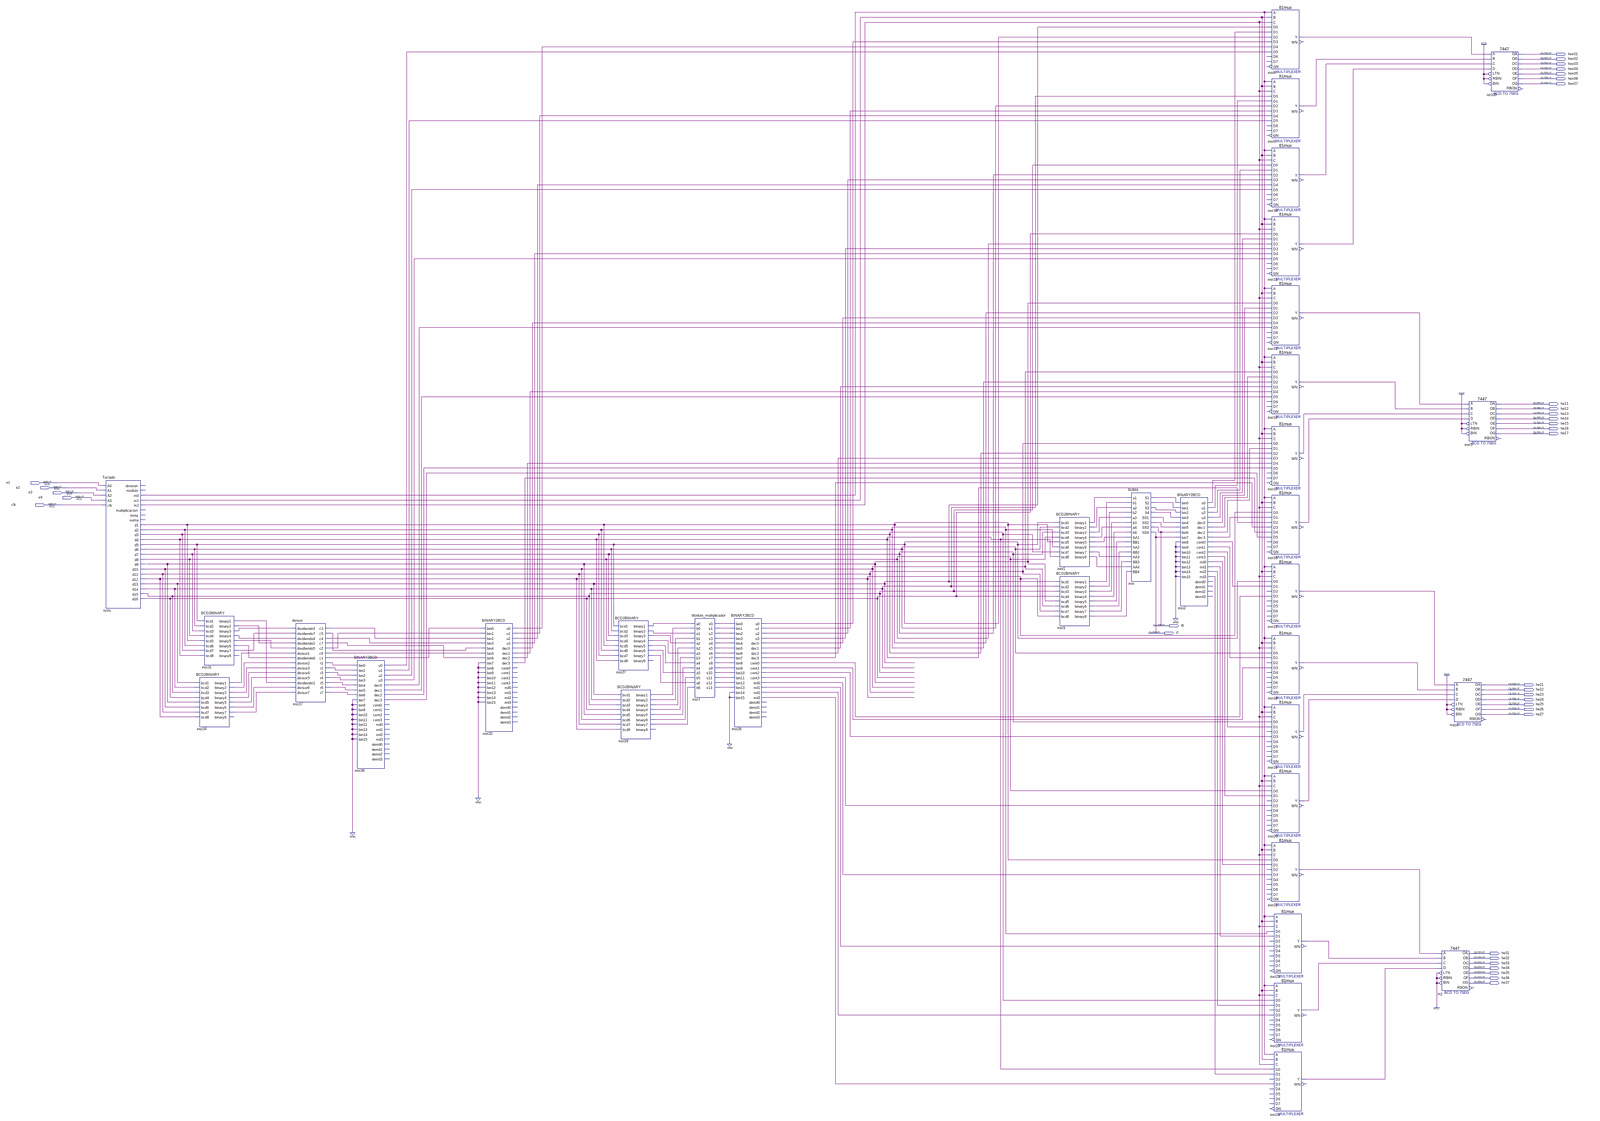
[diagram p0: schematic sheet, whole]
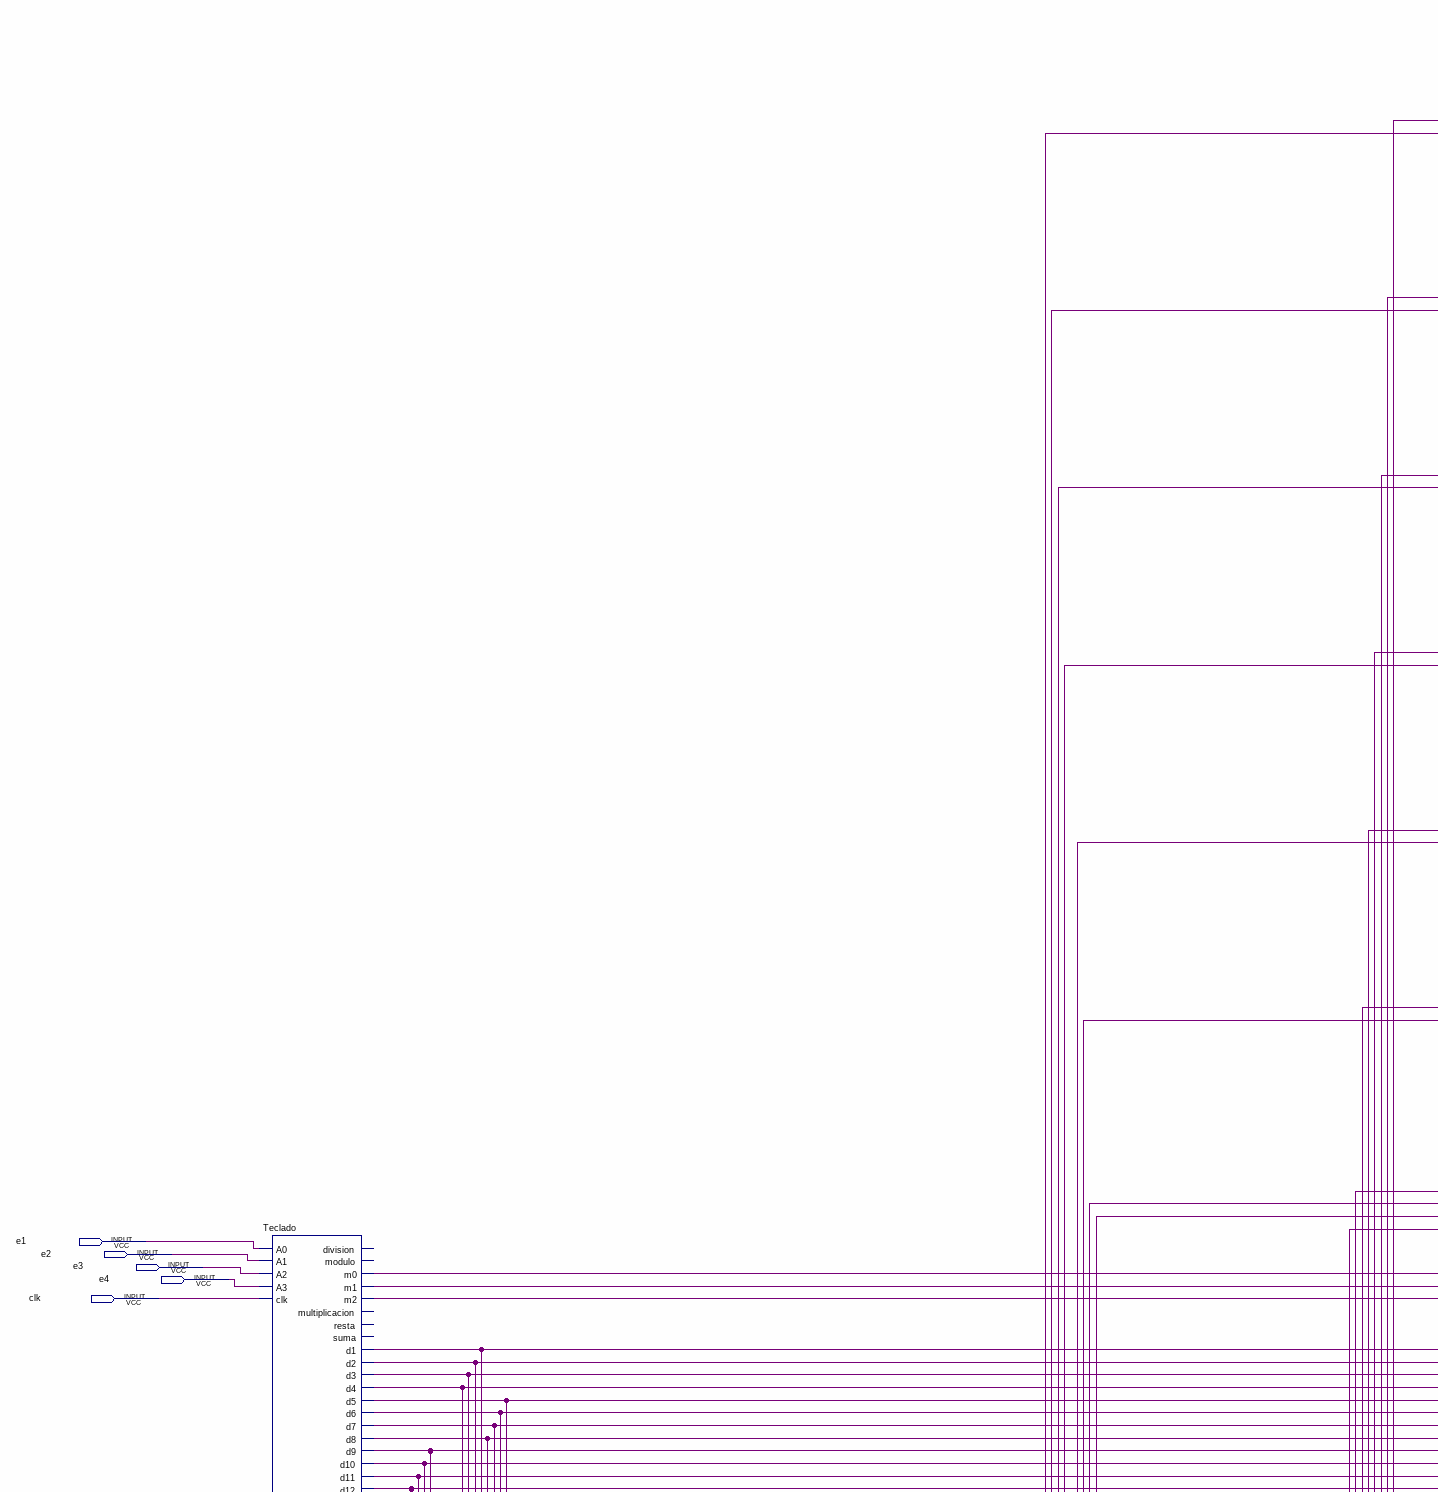
[diagram p1: schematic sheet, upper left part]
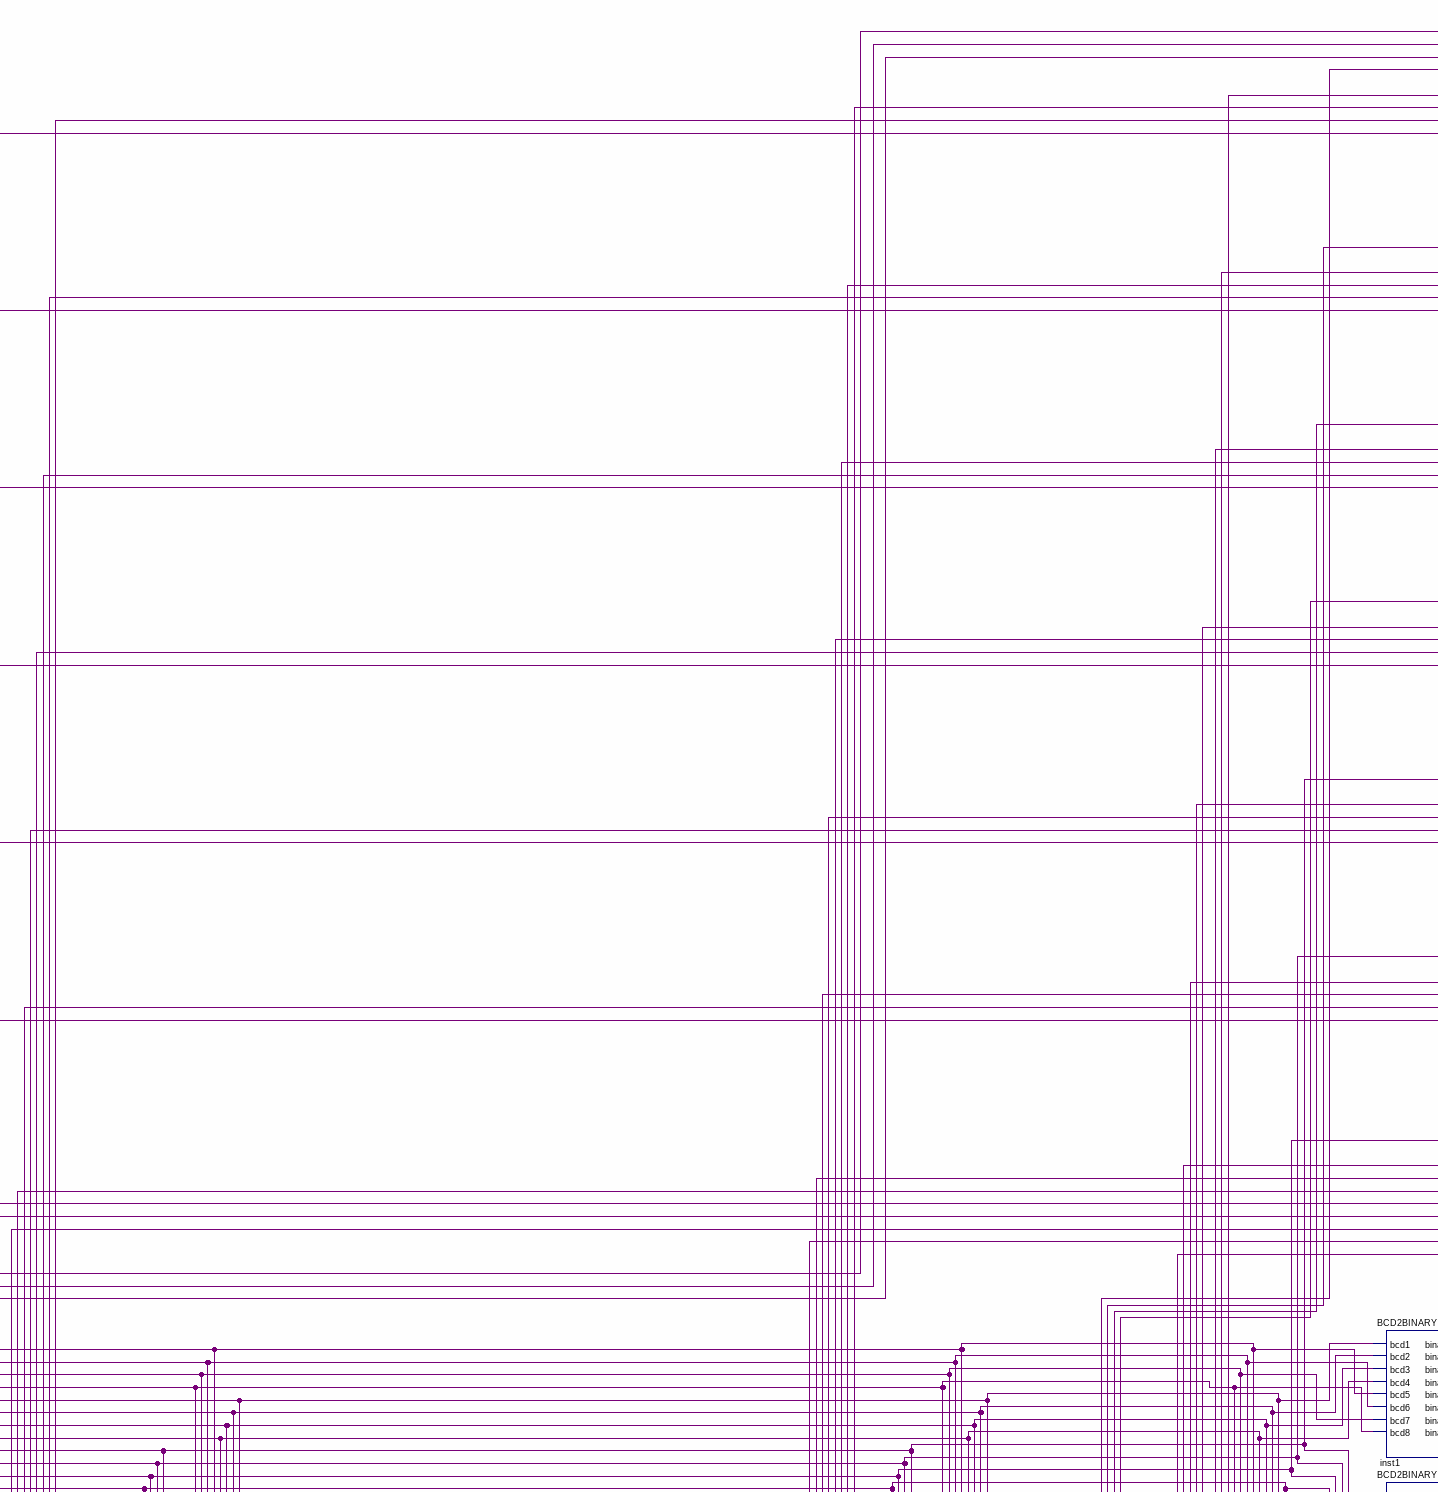
[diagram p2: schematic sheet, upper centre part]
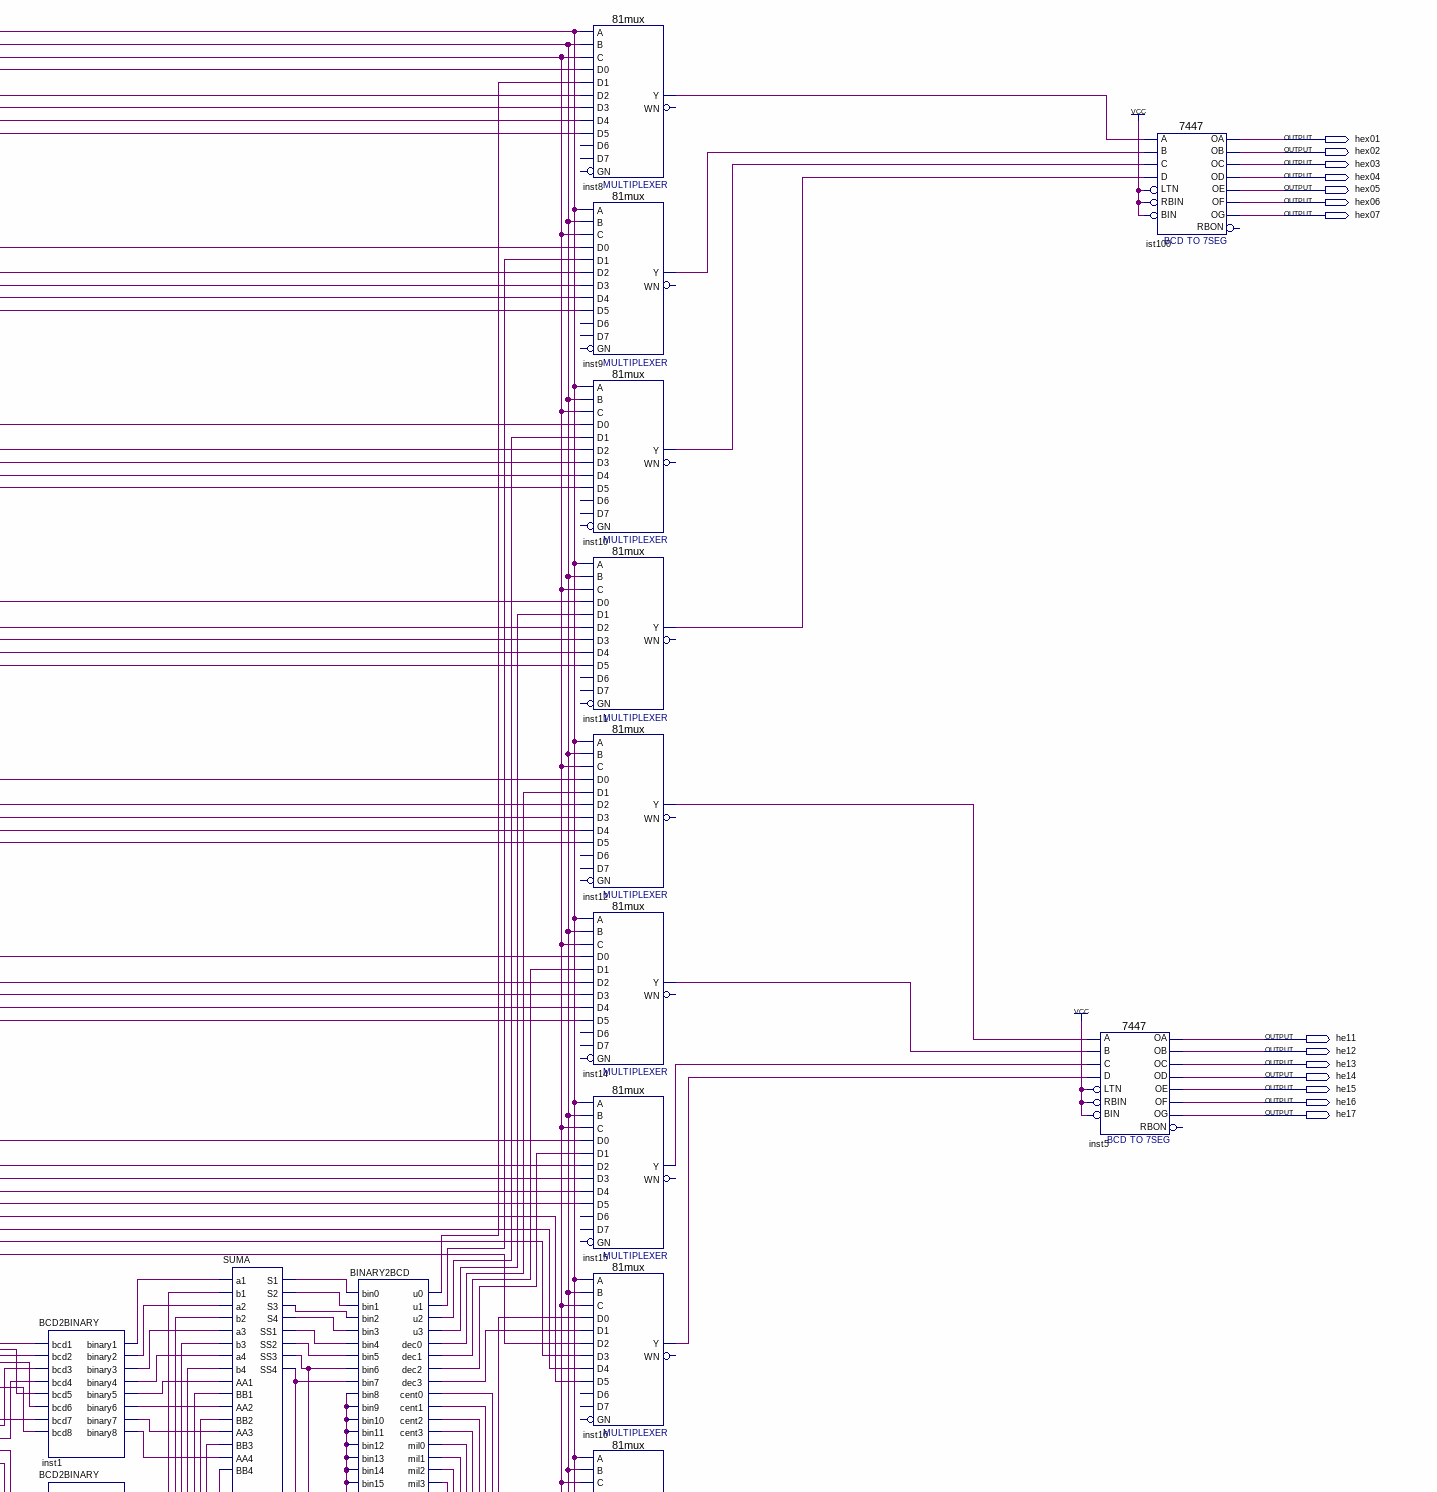
[diagram p3: schematic sheet, upper right part]
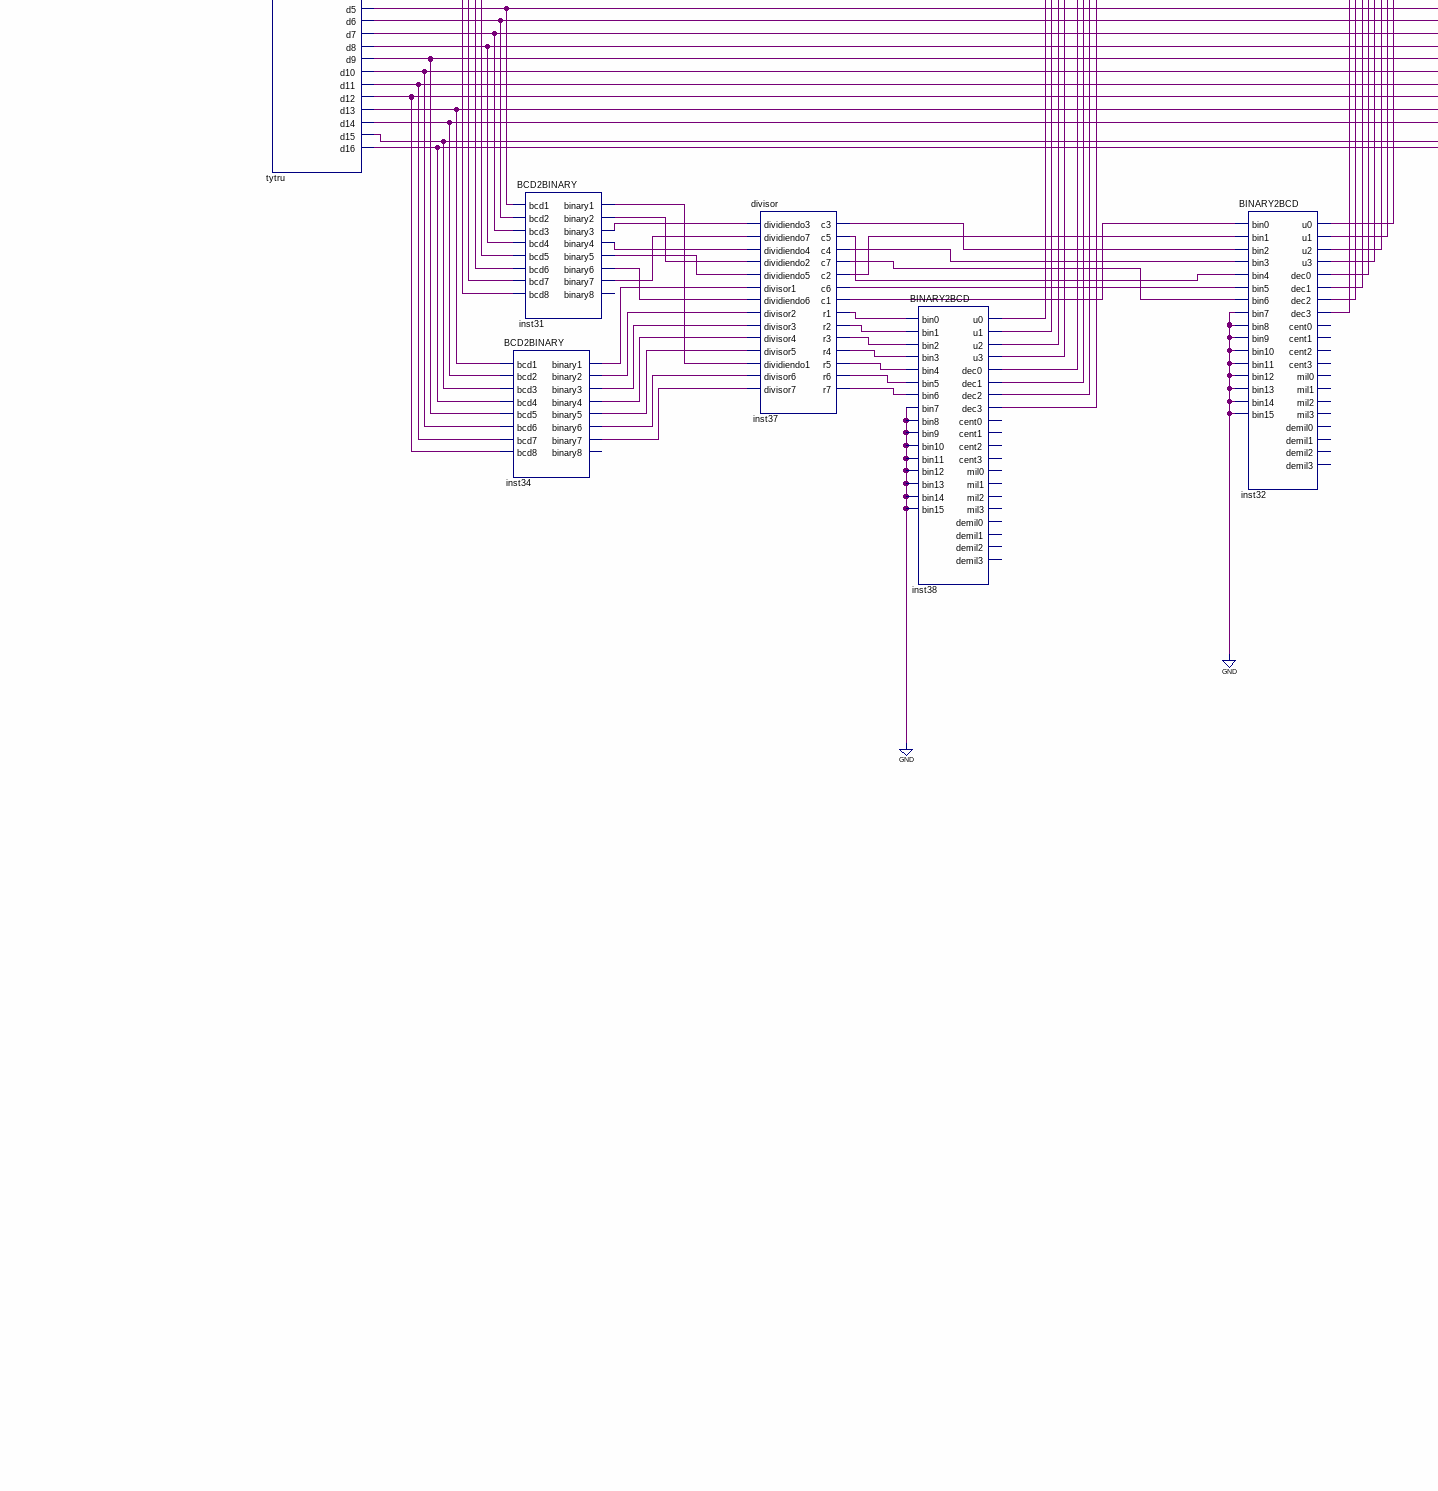
[diagram p4: schematic sheet, lower left part]
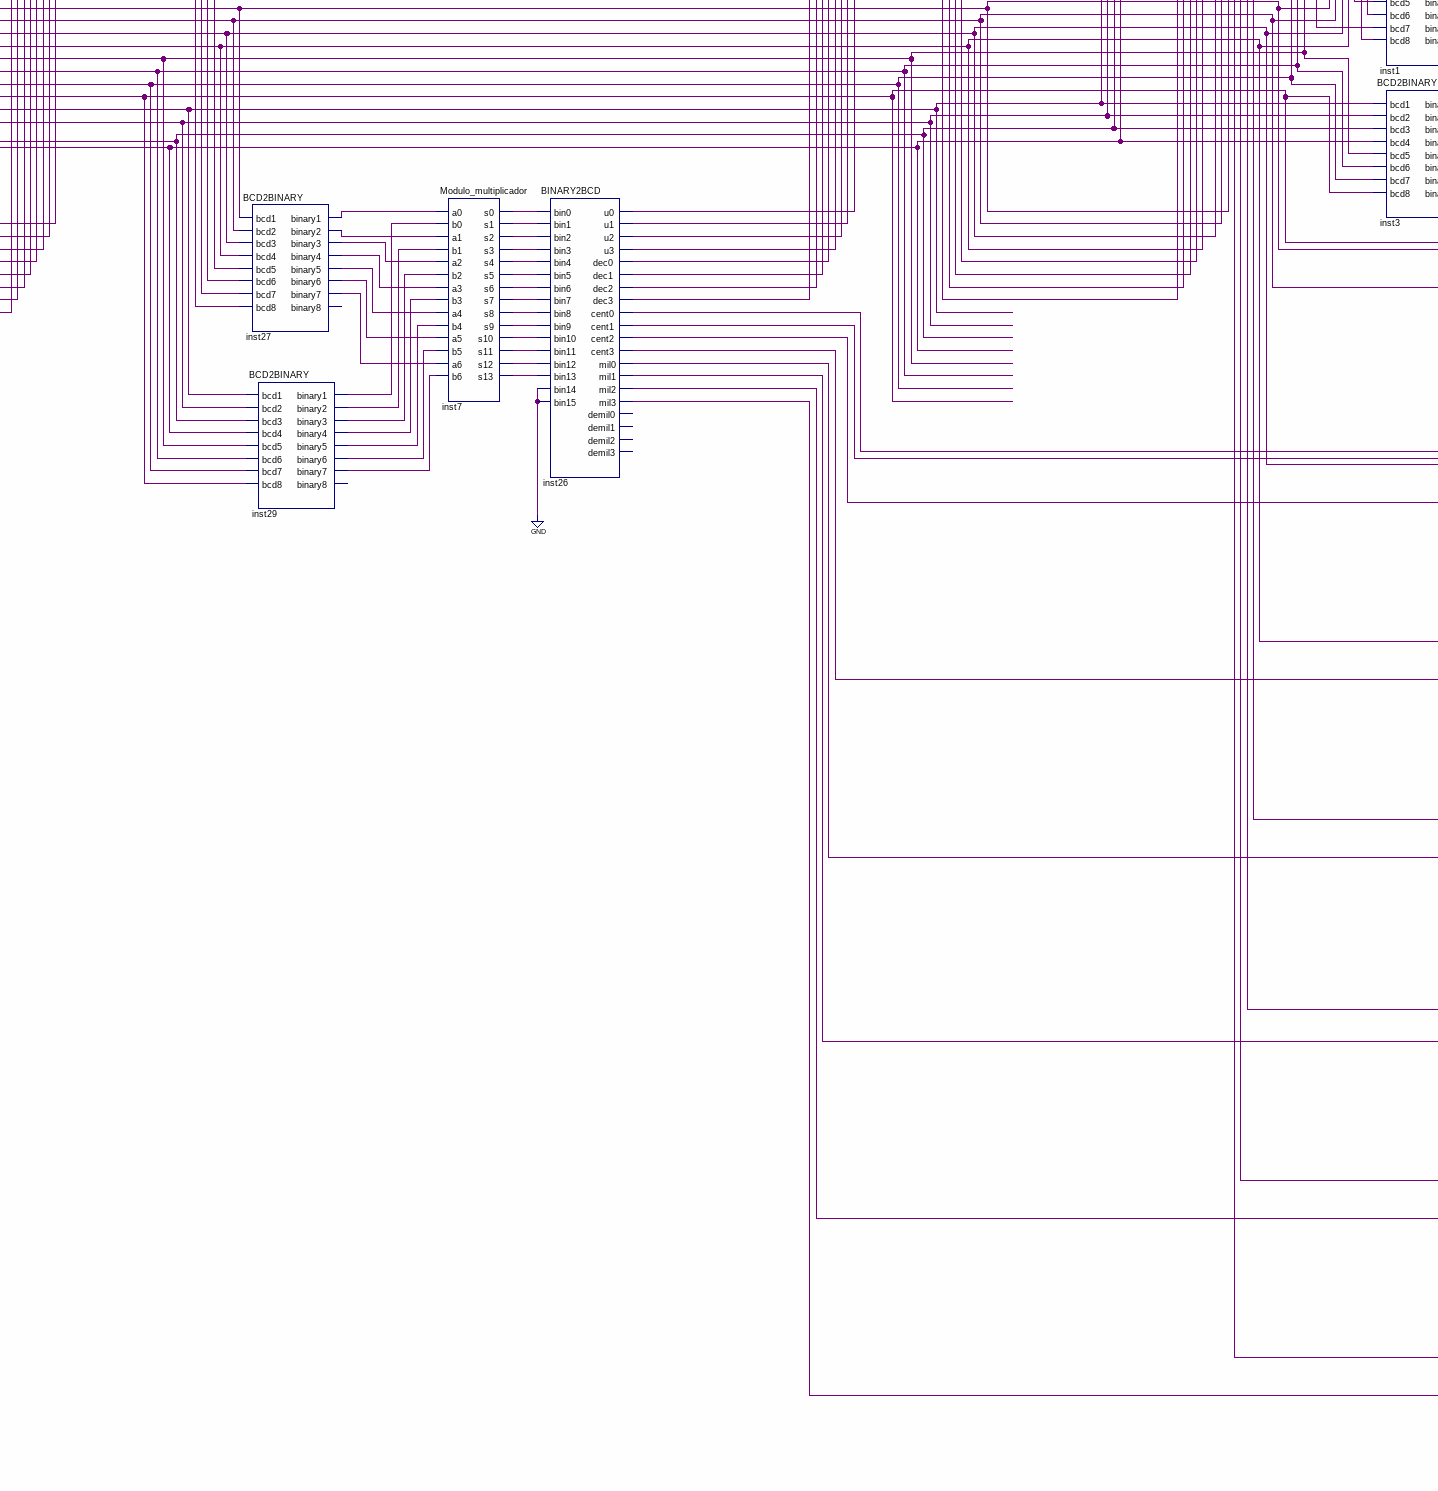
[diagram p5: schematic sheet, lower centre part]
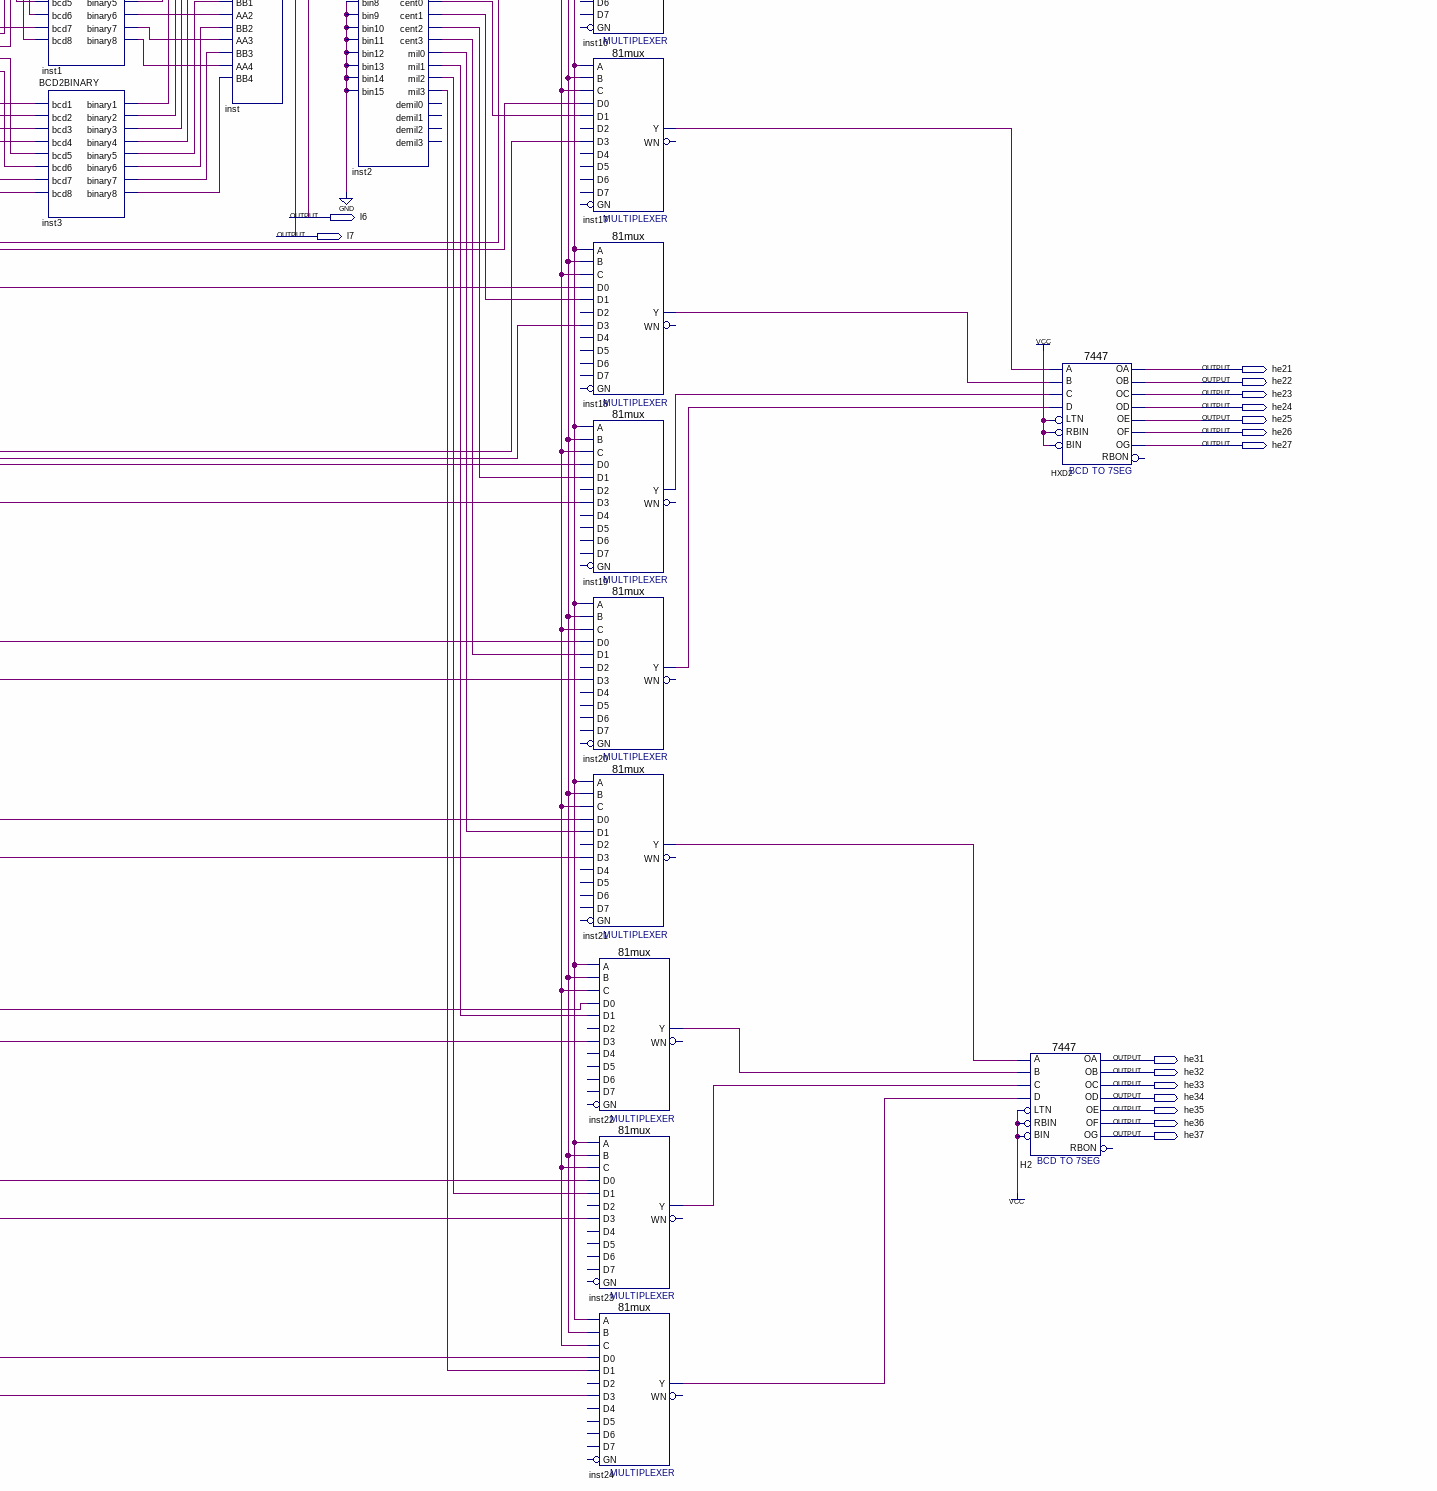
[diagram p6: schematic sheet, lower right part]
// Quartus schematic Final.bdf as structural Verilog: 34 symbols, 35 pins
module Final (
  input  e1,
  input  e2,
  input  e3,
  input  e4,
  input  clk,
  output hex01,
  output hex02,
  output hex03,
  output hex04,
  output hex05,
  output hex06,
  output hex07,
  output he11,
  output he12,
  output he13,
  output he14,
  output he15,
  output he16,
  output he17,
  output l6,
  output l7,
  output he21,
  output he22,
  output he23,
  output he24,
  output he25,
  output he26,
  output he27,
  output he31,
  output he32,
  output he33,
  output he34,
  output he35,
  output he36,
  output he37
);

  wire inst1_binary1, inst1_binary2, inst1_binary3, inst1_binary4, inst1_binary5, inst1_binary6,
       inst1_binary7, inst1_binary8, inst2_cent0, inst2_cent1, inst2_cent2, inst2_cent3, inst2_dec0,
       inst2_dec1, inst2_dec2, inst2_dec3, inst2_mil0, inst2_mil1, inst2_mil2, inst2_mil3, inst2_u0,
       inst2_u1, inst2_u2, inst2_u3, inst3_binary1, inst3_binary2, inst3_binary3, inst3_binary4,
       inst3_binary5, inst3_binary6, inst3_binary7, inst3_binary8, inst7_s0, inst7_s1, inst7_s2, inst7_s3,
       inst7_s4, inst7_s5, inst7_s6, inst7_s7, inst7_s8, inst7_s9, inst7_s10, inst7_s11, inst7_s12,
       inst7_s13, inst8_y, inst9_y, inst10_y, inst11_y, inst12_y, inst14_y, inst15_y, inst16_y, inst17_y,
       inst18_y, inst19_y, inst20_y, inst21_y, inst22_y, inst23_y, inst24_y, inst26_cent0, inst26_cent1,
       inst26_cent2, inst26_cent3, inst26_dec0, inst26_dec1, inst26_dec2, inst26_dec3, inst26_mil0,
       inst26_mil1, inst26_mil2, inst26_mil3, inst26_u0, inst26_u1, inst26_u2, inst26_u3, inst27_binary1,
       inst27_binary2, inst27_binary3, inst27_binary4, inst27_binary5, inst27_binary6, inst27_binary7,
       inst29_binary1, inst29_binary2, inst29_binary3, inst29_binary4, inst29_binary5, inst29_binary6,
       inst29_binary7, inst31_binary1, inst31_binary2, inst31_binary3, inst31_binary4, inst31_binary5,
       inst31_binary6, inst31_binary7, inst32_dec0, inst32_dec1, inst32_dec2, inst32_dec3, inst32_u0,
       inst32_u1, inst32_u2, inst32_u3, inst34_binary1, inst34_binary2, inst34_binary3, inst34_binary4,
       inst34_binary5, inst34_binary6, inst34_binary7, inst37_c1, inst37_c2, inst37_c3, inst37_c4, inst37_c5,
       inst37_c6, inst37_c7, inst37_r1, inst37_r2, inst37_r3, inst37_r4, inst37_r5, inst37_r6, inst37_r7,
       inst38_dec0, inst38_dec1, inst38_dec2, inst38_dec3, inst38_u0, inst38_u1, inst38_u2, inst38_u3,
       inst_s1, inst_s2, inst_s3, inst_s4, inst_ss1, inst_ss2, tytru_d1, tytru_d2, tytru_d3, tytru_d4,
       tytru_d5, tytru_d6, tytru_d7, tytru_d8, tytru_d9, tytru_d10, tytru_d11, tytru_d12, tytru_d13,
       tytru_d14, tytru_d15, tytru_d16, tytru_m0, tytru_m1, tytru_m2;

  Teclado tytru (
    .A0(e1), .A1(e2), .A2(e3), .A3(e4), .clk(clk), .m0(tytru_m0), .m1(tytru_m1), .m2(tytru_m2),
    .d1(tytru_d1), .d2(tytru_d2), .d3(tytru_d3), .d4(tytru_d4), .d5(tytru_d5), .d6(tytru_d6), .d7(tytru_d7),
    .d8(tytru_d8), .d9(tytru_d9), .d10(tytru_d10), .d11(tytru_d11), .d12(tytru_d12), .d13(tytru_d13),
    .d14(tytru_d14), .d15(tytru_d15), .d16(tytru_d16));  // open: division, modulo, multiplicacion, resta, suma
  BCD2BINARY inst34 (
    .bcd1(tytru_d13), .bcd2(tytru_d14), .bcd3(tytru_d15), .bcd4(tytru_d16), .bcd5(tytru_d9),
    .bcd6(tytru_d10), .bcd7(tytru_d11), .bcd8(tytru_d12), .binary1(inst34_binary1), .binary2(inst34_binary2),
    .binary3(inst34_binary3), .binary4(inst34_binary4), .binary5(inst34_binary5), .binary6(inst34_binary6),
    .binary7(inst34_binary7));  // open: binary8
  BCD2BINARY inst31 (
    .bcd1(tytru_d5), .bcd2(tytru_d6), .bcd3(tytru_d7), .bcd4(tytru_d8), .bcd5(tytru_d1), .bcd6(tytru_d2),
    .bcd7(tytru_d3), .bcd8(tytru_d4), .binary1(inst31_binary1), .binary2(inst31_binary2),
    .binary3(inst31_binary3), .binary4(inst31_binary4), .binary5(inst31_binary5), .binary6(inst31_binary6),
    .binary7(inst31_binary7));  // open: binary8
  divisor inst37 (
    .dividiendo3(inst31_binary3), .dividiendo7(inst31_binary7), .dividiendo4(inst31_binary4),
    .dividiendo2(inst31_binary2), .dividiendo5(inst31_binary5), .divisor1(inst34_binary1),
    .dividiendo6(inst31_binary6), .divisor2(inst34_binary2), .divisor3(inst34_binary3),
    .divisor4(inst34_binary4), .divisor5(inst34_binary5), .dividiendo1(inst31_binary1),
    .divisor6(inst34_binary6), .divisor7(inst34_binary7), .c3(inst37_c3), .c5(inst37_c5), .c4(inst37_c4),
    .c7(inst37_c7), .c2(inst37_c2), .c6(inst37_c6), .c1(inst37_c1), .r1(inst37_r1), .r2(inst37_r2),
    .r3(inst37_r3), .r4(inst37_r4), .r5(inst37_r5), .r6(inst37_r6), .r7(inst37_r7));
  BINARY2BCD inst38 (
    .bin0(inst37_r1), .bin1(inst37_r2), .bin2(inst37_r3), .bin3(inst37_r4), .bin4(inst37_r5),
    .bin5(inst37_r6), .bin6(inst37_r7), .bin7(1'b0), .bin8(1'b0), .bin9(1'b0), .bin10(1'b0), .bin11(1'b0),
    .bin12(1'b0), .bin13(1'b0), .bin14(1'b0), .bin15(1'b0), .u0(inst38_u0), .u1(inst38_u1), .u2(inst38_u2),
    .u3(inst38_u3), .dec0(inst38_dec0), .dec1(inst38_dec1), .dec2(inst38_dec2), .dec3(inst38_dec3));  // open: cent0, cent1, cent2, cent3, mil0, mil1, mil2, mil3, demil0, demil1, demil2, demil3
  BINARY2BCD inst32 (
    .bin0(inst37_c1), .bin1(inst37_c2), .bin2(inst37_c3), .bin3(inst37_c4), .bin4(inst37_c5),
    .bin5(inst37_c6), .bin6(inst37_c7), .bin7(1'b0), .bin8(1'b0), .bin9(1'b0), .bin10(1'b0), .bin11(1'b0),
    .bin12(1'b0), .bin13(1'b0), .bin14(1'b0), .bin15(1'b0), .u0(inst32_u0), .u1(inst32_u1), .u2(inst32_u2),
    .u3(inst32_u3), .dec0(inst32_dec0), .dec1(inst32_dec1), .dec2(inst32_dec2), .dec3(inst32_dec3));  // open: cent0, cent1, cent2, cent3, mil0, mil1, mil2, mil3, demil0, demil1, demil2, demil3
  BCD2BINARY inst27 (
    .bcd1(tytru_d5), .bcd2(tytru_d6), .bcd3(tytru_d7), .bcd4(tytru_d8), .bcd5(tytru_d1), .bcd6(tytru_d2),
    .bcd7(tytru_d3), .bcd8(tytru_d4), .binary1(inst27_binary1), .binary2(inst27_binary2),
    .binary3(inst27_binary3), .binary4(inst27_binary4), .binary5(inst27_binary5), .binary6(inst27_binary6),
    .binary7(inst27_binary7));  // open: binary8
  BCD2BINARY inst29 (
    .bcd1(tytru_d13), .bcd2(tytru_d14), .bcd3(tytru_d15), .bcd4(tytru_d16), .bcd5(tytru_d9),
    .bcd6(tytru_d10), .bcd7(tytru_d11), .bcd8(tytru_d12), .binary1(inst29_binary1), .binary2(inst29_binary2),
    .binary3(inst29_binary3), .binary4(inst29_binary4), .binary5(inst29_binary5), .binary6(inst29_binary6),
    .binary7(inst29_binary7));  // open: binary8
  Modulo_multiplicador inst7 (
    .a0(inst27_binary1), .b0(inst29_binary1), .a1(inst27_binary2), .b1(inst29_binary2), .a2(inst27_binary3),
    .b2(inst29_binary3), .a3(inst27_binary4), .b3(inst29_binary4), .a4(inst27_binary5), .b4(inst29_binary5),
    .a5(inst27_binary6), .b5(inst29_binary6), .a6(inst27_binary7), .b6(inst29_binary7), .s0(inst7_s0),
    .s1(inst7_s1), .s2(inst7_s2), .s3(inst7_s3), .s4(inst7_s4), .s5(inst7_s5), .s6(inst7_s6), .s7(inst7_s7),
    .s8(inst7_s8), .s9(inst7_s9), .s10(inst7_s10), .s11(inst7_s11), .s12(inst7_s12), .s13(inst7_s13));
  BINARY2BCD inst26 (
    .bin0(inst7_s0), .bin1(inst7_s1), .bin2(inst7_s2), .bin3(inst7_s3), .bin4(inst7_s4), .bin5(inst7_s5),
    .bin6(inst7_s6), .bin7(inst7_s7), .bin8(inst7_s8), .bin9(inst7_s9), .bin10(inst7_s10), .bin11(inst7_s11),
    .bin12(inst7_s12), .bin13(inst7_s13), .bin14(1'b0), .bin15(1'b0), .u0(inst26_u0), .u1(inst26_u1),
    .u2(inst26_u2), .u3(inst26_u3), .dec0(inst26_dec0), .dec1(inst26_dec1), .dec2(inst26_dec2),
    .dec3(inst26_dec3), .cent0(inst26_cent0), .cent1(inst26_cent1), .cent2(inst26_cent2),
    .cent3(inst26_cent3), .mil0(inst26_mil0), .mil1(inst26_mil1), .mil2(inst26_mil2), .mil3(inst26_mil3));  // open: demil0, demil1, demil2, demil3
  BCD2BINARY inst1 (
    .bcd1(tytru_d5), .bcd2(tytru_d6), .bcd3(tytru_d7), .bcd4(tytru_d8), .bcd5(tytru_d1), .bcd6(tytru_d2),
    .bcd7(tytru_d3), .bcd8(tytru_d4), .binary1(inst1_binary1), .binary2(inst1_binary2),
    .binary3(inst1_binary3), .binary4(inst1_binary4), .binary5(inst1_binary5), .binary6(inst1_binary6),
    .binary7(inst1_binary7), .binary8(inst1_binary8));
  BCD2BINARY inst3 (
    .bcd1(tytru_d13), .bcd2(tytru_d14), .bcd3(tytru_d15), .bcd4(tytru_d16), .bcd5(tytru_d9),
    .bcd6(tytru_d10), .bcd7(tytru_d11), .bcd8(tytru_d12), .binary1(inst3_binary1), .binary2(inst3_binary2),
    .binary3(inst3_binary3), .binary4(inst3_binary4), .binary5(inst3_binary5), .binary6(inst3_binary6),
    .binary7(inst3_binary7), .binary8(inst3_binary8));
  SUMA inst (
    .a1(inst1_binary1), .b1(inst3_binary1), .a2(inst1_binary2), .b2(inst3_binary2), .a3(inst1_binary3),
    .b3(inst3_binary3), .a4(inst1_binary4), .b4(inst3_binary4), .AA1(inst1_binary5), .BB1(inst3_binary5),
    .AA2(inst1_binary6), .BB2(inst3_binary6), .AA3(inst1_binary7), .BB3(inst3_binary7), .AA4(inst1_binary8),
    .BB4(inst3_binary8), .S1(inst_s1), .S2(inst_s2), .S3(inst_s3), .S4(inst_s4), .SS1(inst_ss1),
    .SS2(inst_ss2), .SS3(l6), .SS4(l7));
  BINARY2BCD inst2 (
    .bin0(inst_s1), .bin1(inst_s2), .bin2(inst_s3), .bin3(inst_s4), .bin4(inst_ss1), .bin5(inst_ss2),
    .bin6(l6), .bin7(l7), .bin8(1'b0), .bin9(1'b0), .bin10(1'b0), .bin11(1'b0), .bin12(1'b0), .bin13(1'b0),
    .bin14(1'b0), .bin15(1'b0), .u0(inst2_u0), .u1(inst2_u1), .u2(inst2_u2), .u3(inst2_u3),
    .dec0(inst2_dec0), .dec1(inst2_dec1), .dec2(inst2_dec2), .dec3(inst2_dec3), .cent0(inst2_cent0),
    .cent1(inst2_cent1), .cent2(inst2_cent2), .cent3(inst2_cent3), .mil0(inst2_mil0), .mil1(inst2_mil1),
    .mil2(inst2_mil2), .mil3(inst2_mil3));  // open: demil0, demil1, demil2, demil3
  \81mux  inst8 (
    .C(tytru_m2), .D1(inst2_u0), .D0(tytru_d13), .D5(inst38_u0), .D4(inst32_u0), .D2(tytru_d5),
    .D3(inst26_u0), .A(tytru_m0), .B(tytru_m1), .Y(inst8_y));  // open: GN, D7, D6, WN
  \81mux  inst9 (
    .C(tytru_m2), .D1(inst2_u1), .D0(tytru_d14), .D5(inst38_u1), .D4(inst32_u1), .D2(tytru_d6),
    .D3(inst26_u1), .A(tytru_m0), .B(tytru_m1), .Y(inst9_y));  // open: GN, D7, D6, WN
  \81mux  inst10 (
    .C(tytru_m2), .D1(inst2_u2), .D0(tytru_d15), .D5(inst38_u2), .D4(inst32_u2), .D2(tytru_d7),
    .D3(inst26_u2), .A(tytru_m0), .B(tytru_m1), .Y(inst10_y));  // open: GN, D7, D6, WN
  \81mux  inst11 (
    .C(tytru_m2), .D1(inst2_u3), .D0(tytru_d16), .D5(inst38_u3), .D4(inst32_u3), .D2(tytru_d8),
    .D3(inst26_u3), .A(tytru_m0), .B(tytru_m1), .Y(inst11_y));  // open: GN, D7, D6, WN
  \81mux  inst12 (
    .C(tytru_m2), .D1(inst2_dec0), .D0(tytru_d9), .D5(inst38_dec0), .D4(inst32_dec0), .D2(tytru_d1),
    .D3(inst26_dec0), .A(tytru_m0), .B(tytru_m1), .Y(inst12_y));  // open: GN, D7, D6, WN
  \81mux  inst14 (
    .C(tytru_m2), .D1(inst2_dec1), .D0(tytru_d10), .D5(inst38_dec1), .D4(inst32_dec1), .D2(tytru_d2),
    .D3(inst26_dec1), .A(tytru_m0), .B(tytru_m1), .Y(inst14_y));  // open: GN, D7, D6, WN
  \81mux  inst15 (
    .C(tytru_m2), .D1(inst2_dec2), .D0(tytru_d11), .D5(inst38_dec2), .D4(inst32_dec2), .D2(tytru_d3),
    .D3(inst26_dec2), .A(tytru_m0), .B(tytru_m1), .Y(inst15_y));  // open: GN, D7, D6, WN
  \81mux  inst16 (
    .C(tytru_m2), .D1(inst2_dec3), .D0(tytru_d12), .D5(inst38_dec3), .D4(inst32_dec3), .D2(tytru_d4),
    .D3(inst26_dec3), .A(tytru_m0), .B(tytru_m1), .Y(inst16_y));  // open: GN, D7, D6, WN
  \81mux  inst17 (
    .C(tytru_m2), .D1(inst2_cent0), .D0(tytru_d5), .D3(inst26_cent0), .A(tytru_m0), .B(tytru_m1), .Y(inst17_y));  // open: D5, D4, D2, GN, D7, D6, WN
  \81mux  inst18 (
    .C(tytru_m2), .D1(inst2_cent1), .D0(tytru_d6), .D3(inst26_cent1), .A(tytru_m0), .B(tytru_m1), .Y(inst18_y));  // open: D5, D4, D2, GN, D7, D6, WN
  \81mux  inst19 (
    .C(tytru_m2), .D1(inst2_cent2), .D0(tytru_d7), .D3(inst26_cent2), .A(tytru_m0), .B(tytru_m1), .Y(inst19_y));  // open: D5, D4, D2, GN, D7, D6, WN
  \81mux  inst20 (
    .C(tytru_m2), .D1(inst2_cent3), .D0(tytru_d8), .D3(inst26_cent3), .A(tytru_m0), .B(tytru_m1), .Y(inst20_y));  // open: D5, D4, D2, GN, D7, D6, WN
  \81mux  inst21 (
    .C(tytru_m2), .D1(inst2_mil0), .D0(tytru_d1), .D3(inst26_mil0), .A(tytru_m0), .B(tytru_m1), .Y(inst21_y));  // open: D5, D4, D2, GN, D7, D6, WN
  \81mux  inst22 (
    .C(tytru_m2), .D1(inst2_mil1), .D0(tytru_d2), .D3(inst26_mil1), .A(tytru_m0), .B(tytru_m1), .Y(inst22_y));  // open: D5, D4, D2, GN, D7, D6, WN
  \81mux  inst23 (
    .C(tytru_m2), .D1(inst2_mil2), .D0(tytru_d3), .D3(inst26_mil2), .A(tytru_m0), .B(tytru_m1), .Y(inst23_y));  // open: D5, D4, D2, GN, D7, D6, WN
  \81mux  inst24 (
    .C(tytru_m2), .D1(inst2_mil3), .D0(tytru_d4), .D3(inst26_mil3), .A(tytru_m0), .B(tytru_m1), .Y(inst24_y));  // open: D5, D4, D2, GN, D7, D6, WN
  \7447  H2 (
    .LTN(1'b1), .B(inst22_y), .C(inst23_y), .D(inst24_y), .RBIN(1'b1), .BIN(1'b1), .A(inst21_y), .OB(he32),
    .OC(he33), .OE(he35), .OD(he34), .OF(he36), .OG(he37), .OA(he31));  // open: RBON
  \7447  HXD2 (
    .LTN(1'b1), .B(inst18_y), .C(inst19_y), .D(inst20_y), .RBIN(1'b1), .BIN(1'b1), .A(inst17_y), .OB(he22),
    .OC(he23), .OE(he25), .OD(he24), .OF(he26), .OG(he27), .OA(he21));  // open: RBON
  \7447  inst5 (
    .LTN(1'b1), .B(inst14_y), .C(inst15_y), .D(inst16_y), .RBIN(1'b1), .BIN(1'b1), .A(inst12_y), .OB(he12),
    .OC(he13), .OE(he15), .OD(he14), .OF(he16), .OG(he17), .OA(he11));  // open: RBON
  \7447  ist100 (
    .LTN(1'b1), .B(inst9_y), .C(inst10_y), .D(inst11_y), .RBIN(1'b1), .BIN(1'b1), .A(inst8_y), .OB(hex02),
    .OC(hex03), .OE(hex05), .OD(hex04), .OF(hex06), .OG(hex07), .OA(hex01));  // open: RBON
endmodule
